# Altium schematic sheet [04] - REVISION HISTORY.SchDoc
size A3; DocumentNumber: 4; SheetNumber: 4; SheetTotal: 5
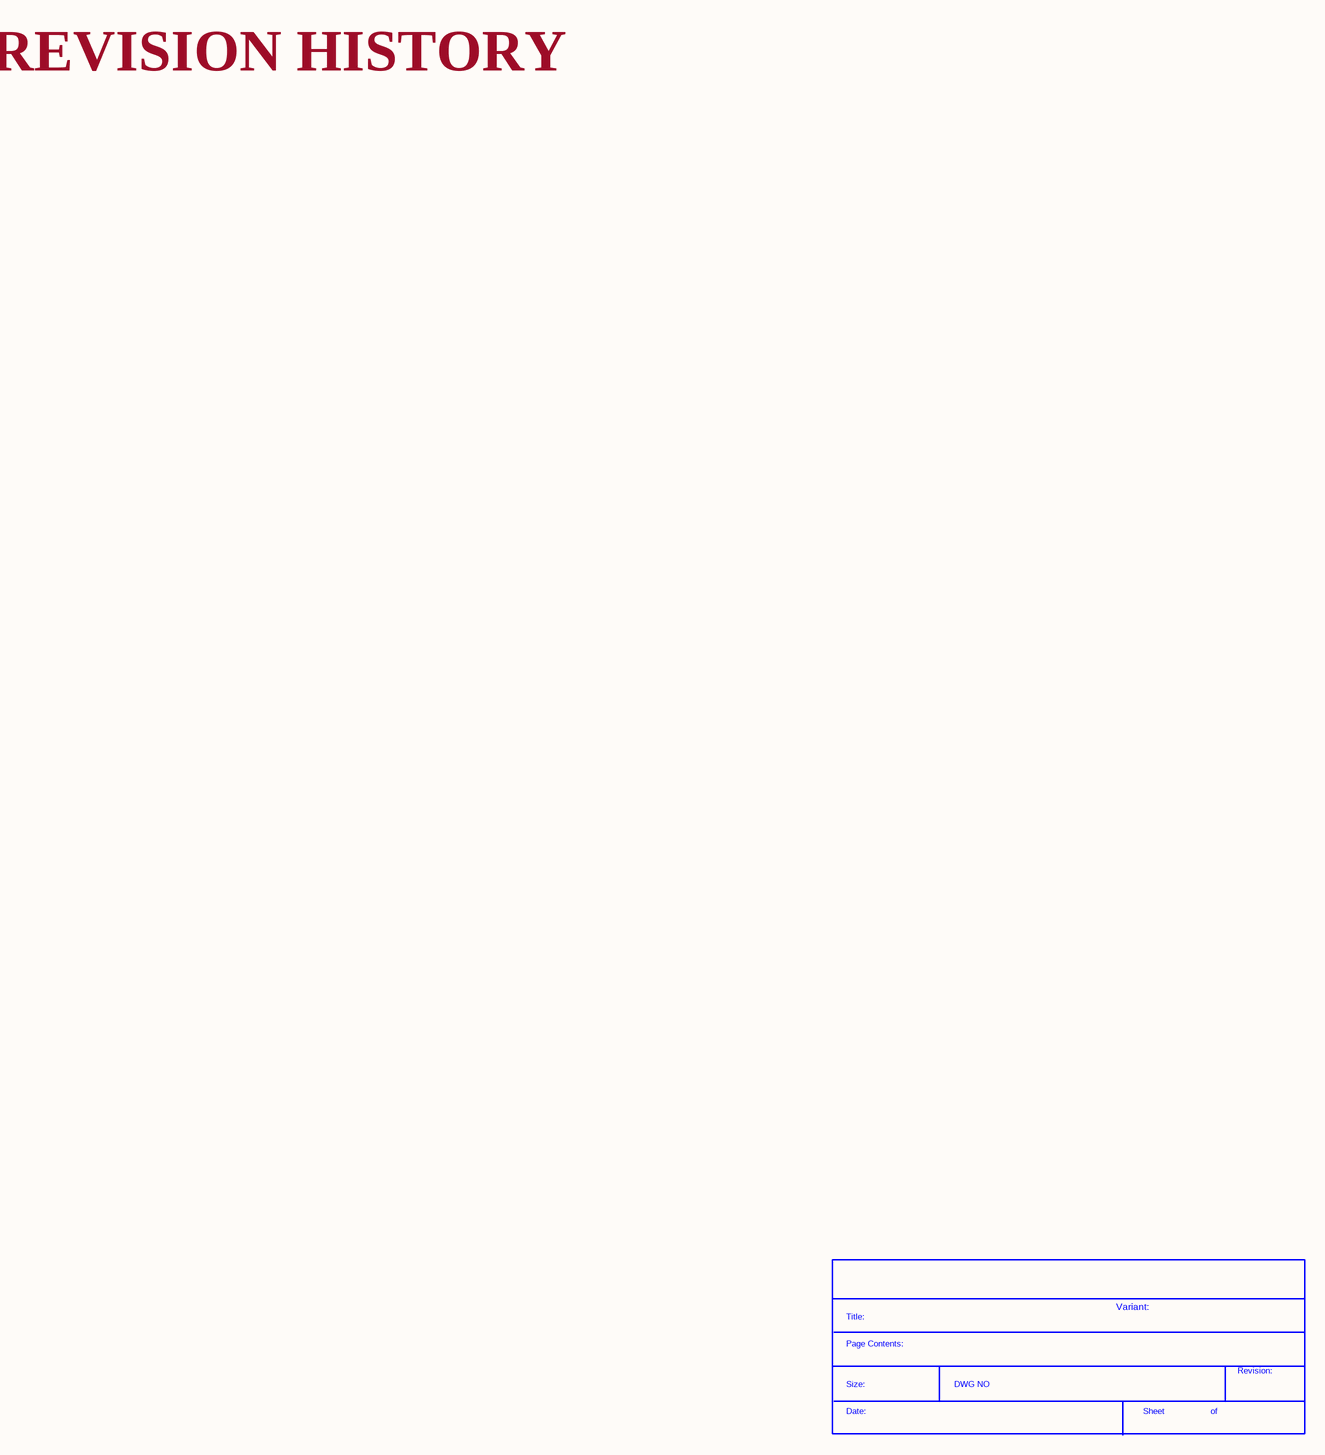
[diagram p0: [04] - REVISION HISTORY.SchDoc]

## Parts
*  SDTitleBlock  (value not drawn)  (graphical)

## Notes on the sheet
- REVISION HISTORY
- Variant:
- (in symbol SDTitleBlock) Title:; Page Contents:; Revision:; Size:; DWG NO; Date:; Sheet; of